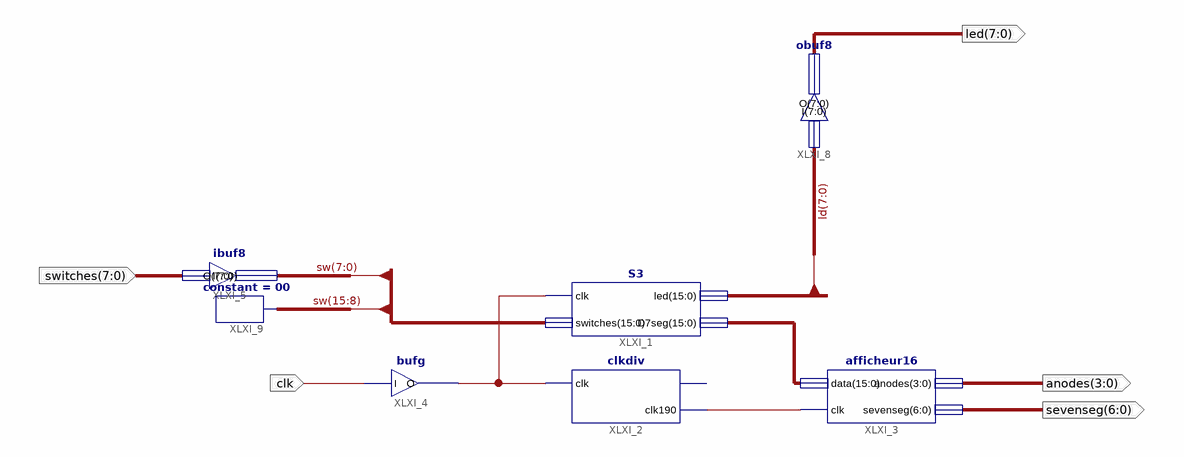
[diagram p0: schematic sheet 1]
// Xilinx ISE schematic toplevel.sch (spartan3e) as structural Verilog: 7 symbols, 5 ports
module toplevel (
  input  clk,
  input  [7:0] switches,
  output [7:0] led,
  output [3:0] anodes,
  output [6:0] sevenseg
);

  wire XLXN_1, XLXN_5;
  wire [15:0] ld, sw, XLXN_2;

  S3 XLXI_1 (.clk(XLXN_5), .switches(sw), .led(ld), .D7seg(XLXN_2));
  clkdiv XLXI_2 (.clk(XLXN_5), .clk190(XLXN_1));  // open: clksec
  afficheur16 XLXI_3 (.data(XLXN_2), .clk(XLXN_1), .anodes(anodes), .sevenseg(sevenseg));
  bufg XLXI_4 (.I(clk), .O(XLXN_5));
  ibuf8 XLXI_5 (.I(switches), .O(sw[7:0]));
  obuf8 XLXI_8 (.I(ld[7:0]), .O(led));
  constant #(.CValue("00")) XLXI_9 (.O(sw[15:8]));
endmodule
